# Altium project WirelessCharger.PrjPcb
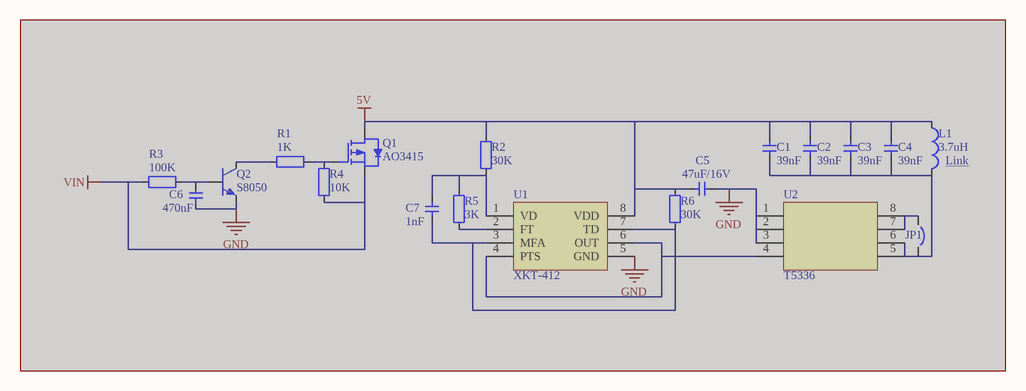
[diagram p0: PowerSender.SchDoc]
3 sheets, 62 parts. Net scope: global (net labels, ports and power ports of the same name join across sheets).
Board files: PowerSender.PcbDoc, PowerReceiver.PcbDoc, MotorController.PcbDoc
Sheets:
  PowerSender.SchDoc
  PowerReceiver.SchDoc
  MotorController.SchDoc

## Sheet PowerSender.SchDoc
size A4

### Parts
(Parts that share a designator on the sheet are numbered #1, #2 ... from top to bottom, then left to right.)
C1#1  39nF  [CAP_1206]  (masked out: inside a compile mask, not in the netlist)
C2#1  39nF  [CAP_1206]  (masked out: inside a compile mask, not in the netlist)
C3#1  39nF  [CAP_1206]  (masked out: inside a compile mask, not in the netlist)
C4  39nF  [CAP_1206]  (masked out: inside a compile mask, not in the netlist)
C5  47uF/16V  [CAP_1206]  (masked out: inside a compile mask, not in the netlist)
C6  470nF  [CAP_0805]  (masked out: inside a compile mask, not in the netlist)
C7  1nF  [CAP_0805]  (masked out: inside a compile mask, not in the netlist)
JP1  (no value)  [JP_SMD]  (masked out: inside a compile mask, not in the netlist)
L1#1  3.7uH  [IND_1210]  (masked out: inside a compile mask, not in the netlist)
Q1  AO3415  [SOT323]  (masked out: inside a compile mask, not in the netlist)
Q2  S8050  [SOT23-3]  (masked out: inside a compile mask, not in the netlist)
R1#1  value 1K  [RES_0603]  (hidden comment: Res_0603)  (masked out: inside a compile mask, not in the netlist)
R2#1  value 30K  [RES_0603]  (hidden comment: Res_0603)  (masked out: inside a compile mask, not in the netlist)
R3#1  value 100K  [RES_0603]  (hidden comment: Res_0603)  (masked out: inside a compile mask, not in the netlist)
R4#1  value 10K  [RES_0603]  (hidden comment: Res_0603)  (masked out: inside a compile mask, not in the netlist)
R5#1  value 3K  [RES_0603]  (hidden comment: Res_0603)  (masked out: inside a compile mask, not in the netlist)
R6#1  value 30K  [RES_0603]  (hidden comment: Res_0603)  (masked out: inside a compile mask, not in the netlist)
U1#1  XKT-412  [SOIC_8]  (masked out: inside a compile mask, not in the netlist)
U2#1  T5336  [SOIC_8]  (masked out: inside a compile mask, not in the netlist)

### Notes on the sheet
- (near L1#1) Link <https://item.taobao.com/item.htm?spm=a1z0d.6639537.1997196601.67.swHxrp&id=41516185666>

### Library data of the parts
C1#1 C2#1 C3#1 C4 C5 = Cap_1206: Capacitor; Value: ?F
C6 C7 = Cap_0805: Capacitor; Value: ?F
JP1 = Jumper
L1#1 = Ind_1210: Inductor; Value: ?H
Q1 = PMOS
Q2 = BJT_NPN: Transistor
R1#1 R2#1 R3#1 R4#1 R5#1 R6#1 = Res_0603: Resistor
U1#1 = XKT-412: Wireless charging sender
U2#1 = T5336: Wireless charging IC

## Sheet PowerReceiver.SchDoc
size A4
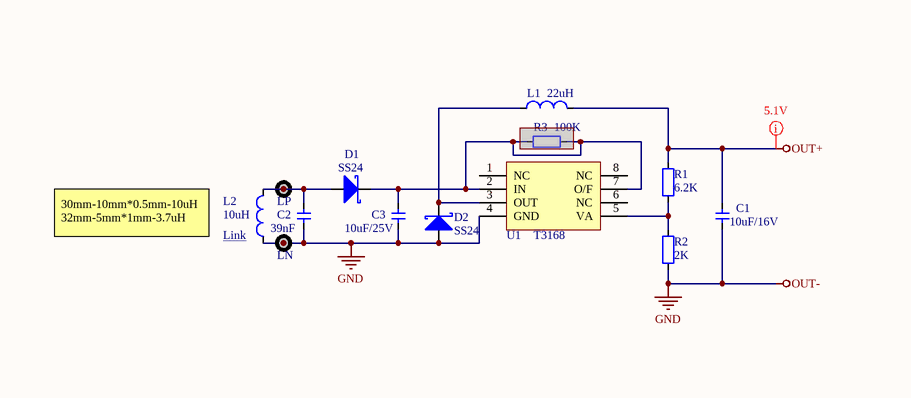
[diagram p1: PowerReceiver.SchDoc]

### Parts
(Parts that share a designator on the sheet are numbered #1, #2 ... from top to bottom, then left to right.)
C1#2  10uF/16V  [CAP_1206]
C2#2  39nF  [CAP_1206]
C3#2  10uF/25V  [CAP_1206]
D1#1  SS24  [DO-214AC]
D2#1  SS24  [DO-214AC]
L1#2  22uH  [IND_0403]
L2  10uH  [IND_1210]
LN  TestPoint  [TestPoint_0.8mm]  (value not drawn)
LP  TestPoint  [TestPoint_0.8mm]  (value not drawn)
R1#2  value 6.2K  [RES_0603]  (hidden comment: Res_0603)
R2#2  value 2K  [RES_0603]  (hidden comment: Res_0603)
R3#2  100K  [RES_0603]  (masked out: inside a compile mask, not in the netlist)
U1#2  T3168  [SOIC_8]

### Nets
GND: C1#2.1 C2#2.1 C3#2.1 D2#1.1(A) L2.1 LN.1(TP) R2#2.1 U1#2.4(GND)  [also labelled OUT-]
OUT+: C1#2.2 L1#2.2 R1#2.2
NetC2#2_2: C2#2.2 D1#1.1(A) L2.2 LP.1(TP)
NetC3#2_2: C3#2.2 D1#1.2(K) U1#2.2(IN) U1#2.7(O/F)
NetD2#1_2: D2#1.2(K) L1#2.1 U1#2.3(OUT)
NetR1#2_1: R1#2.1 R2#2.2 U1#2.5(VA)

Not connected (* = marked no-connect by the designer): U1#2 1(NC) 6(NC) 8(NC)

### Layout directives
mark named 5.1V: OUT+

### Notes on the sheet
- 30mm-10mm*0.5mm-10uH
  32mm-5mm*1mm-3.7uH
- (near L2) Link <https://item.taobao.com/item.htm?spm=a1z0d.6639537.1997196601.58.swHxrp&id=529508692700>

### Library data of the parts
C1#2 C2#2 C3#2 = Cap_1206: Capacitor; Value: ?F
D1#1 D2#1 = Diode_Schottky: Diode
L1#2 L2 = Ind_1210: Inductor; Value: ?H
R1#2 R2#2 = Res_0603: Resistor
R3#2 = Res_0603: Resistor; Value: ?K
U1#2 = T3168: Wireless charging reciver

## Sheet MotorController.SchDoc
size A4
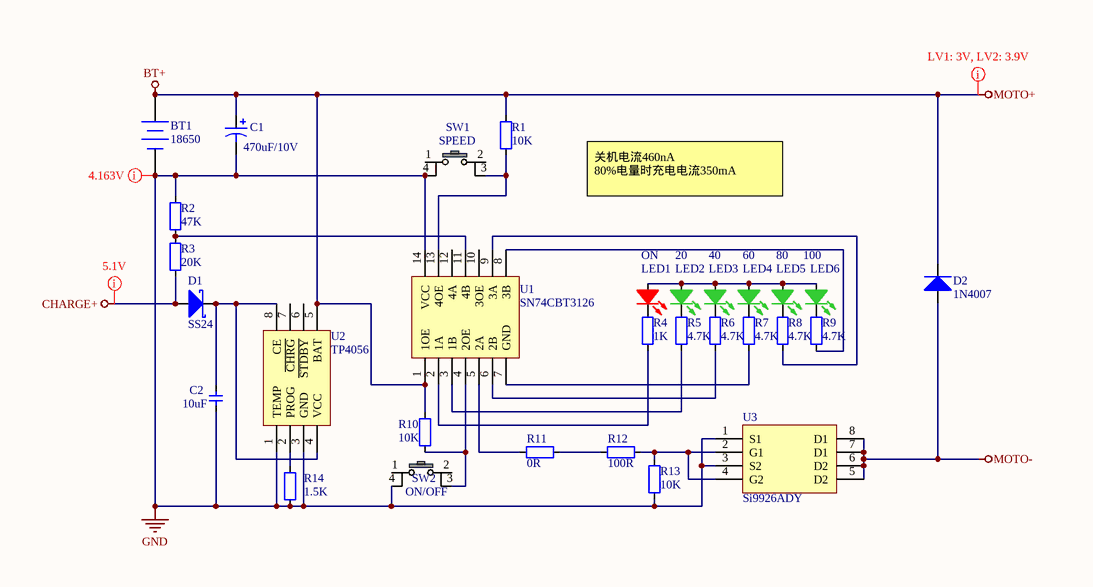
[diagram p2: MotorController.SchDoc]

### Parts
(Parts that share a designator on the sheet are numbered #1, #2 ... from top to bottom, then left to right.)
BT1  18650  [BAT-2]
C1#3  470uF/10V  [RB7.6-15]
C2#3  10uF  [CAP_1206]
D1#2  SS24  [DO-214AC]
D2#2  1N4007  [SOD123]
LED1  ON  [LED_0603_RED]
LED2  20  [LED_0603_GREEN]
LED3  40  [LED_0603_GREEN]
LED4  60  [LED_0603_GREEN]
LED5  80  [LED_0603_GREEN]
LED6  100  [LED_0603_GREEN]
R1#3  10K  [RES_0603]
R2#3  47K  [RES_0805]
R3#3  20K  [RES_0805]
R4#2  1K  [RES_0603]
R5#2  4.7K  [RES_0603]
R6#2  4.7K  [RES_0603]
R7  4.7K  [RES_0603]
R8  4.7K  [RES_0603]
R9  4.7K  [RES_0603]
R10  10K  [RES_0603]
R11  0R  [RES_0603]
R12  100R  [RES_0603]
R13  10K  [RES_0603]
R14  1.5K  [RES_0603]
SW1  SPEED  [SWITCH_SMD]
SW2  ON/OFF  [SWITCH_SMD]
U1#3  SN74CBT3126  [SN74CBT3126PWR]
U2#2  TP4056  [SOIC_8]
U3  Si9926ADY  [SOIC_8]

### Nets
BT+: BT1.1(+) C1#3.1 D2#2.2(K) R1#3.2 R10.1 U1#3.1(1OE) U2#2.5(BAT)  [also labelled MOTO+]
CHARGE+: D1#2.1(A) R3#3.1
GND: BT1.2(-) C1#3.2 C2#3.1 R2#3.2 R13.2 R14.2 SW1.4 SW2.4 U1#3.14(VCC) U2#2.1(TEMP) U2#2.3(GND) U3.1(S1) U3.3(S2)
MOTO-: D2#2.1(A) U3.5(D2) U3.6(D2) U3.7(D1) U3.8(D1)
NetC2#3_2: C2#3.2 D1#2.2(K) U2#2.4(VCC) U2#2.8(CE)
NetLED1_1: LED1.1(A) LED2.1(A) LED3.1(A) LED4.1(A) LED5.1(A) LED6.1(A)
NetLED1_2: LED1.2(K) R4#2.1
NetLED2_2: LED2.2(K) R5#2.1
NetLED3_2: LED3.2(K) R6#2.1
NetLED4_2: LED4.2(K) R7.1
NetLED5_2: LED5.2(K) R8.1
NetLED6_2: LED6.2(K) R9.1
NetR1#3_1: R1#3.1 SW1.3 U1#3.13(4OE)
NetR2#3_1: R2#3.1 R3#3.2 U1#3.11(4B)
NetR4#2_2: R4#2.2 U1#3.2(1A)
NetR5#2_2: R5#2.2 U1#3.3(1B)
NetR6#2_2: R6#2.2 U1#3.6(2B)
NetR7_2: R7.2 U1#3.7(GND)
NetR8_2: R8.2 U1#3.9(3A)
NetR9_2: R9.2 U1#3.8(3B)
NetR10_2: R10.2 SW2.3 U1#3.4(2OE)
NetR11_1: R11.1 U1#3.5(2A)
NetR11_2: R11.2 R12.1
NetR12_2: R12.2 R13.1 U3.2(G1) U3.4(G2)
NetR14_1: R14.1 U2#2.2(PROG)

Not connected (* = marked no-connect by the designer): SW1 1 2; SW2 1 2; U1#3 10(3OE) 12(4A); U2#2 6(~{STDBY}) 7(~{CHRG})

### Layout directives
mark named 4.163V: GND
mark named 5.1V: CHARGE+
mark named LV1: 3V, LV2: 3.9V: BT+

### Notes on the sheet
- 关机电流460nA
  80%电量时充电电流350mA

### Library data of the parts
BT1 = Battery: Multicell Battery; Published: 24-Mar-1999; LatestRevisionDate: 17-Jul-2002; LatestRevisionNote: Re-released for DXP Platform.; PackageReference: BAT-2; Publisher: Altium Limited; PackageDescription: Battery; 2 Leads
C1#3 = Cap Pol1: Polarized Capacitor (Radial); Value: 100pF; Published: 8-Jun-2000; LatestRevisionDate: 17-Jul-2002; LatestRevisionNote: Re-released for DXP Platform.; PackageReference: RB7.6-15; Publisher: Altium Limited; PackageDescription: Polarized Capacitor (Radial); 2 Leads
C2#3 = Cap_1206: Capacitor; Value: ?F
D1#2 = Diode_Schottky: Diode
D2#2 = Diode_SOD323: Diode; SOD323: 1N?
LED1 = LED_0603_RED: LED
LED2-LED6 = LED_0603_GREEN: LED
R1#3 R4#2 R5#2 R6#2 R7-R14 = Res_0603: Resistor; Value: ?K
R2#3 R3#3 = Res_0805: Resistor; Value: ?K
SW1 SW2 = SWITCH: 6*6
U1#3 = SN74CBT3126: 74 Series
U2#2 = TP4056: Li-lon Battery Charger
U3 = SI9926: Dual N-Channel P ower MOSFET

## Nets that join several sheets
GND: PowerReceiver (8 pins), MotorController (13 pins)